# Altium project LARIX_V5.PrjPcb
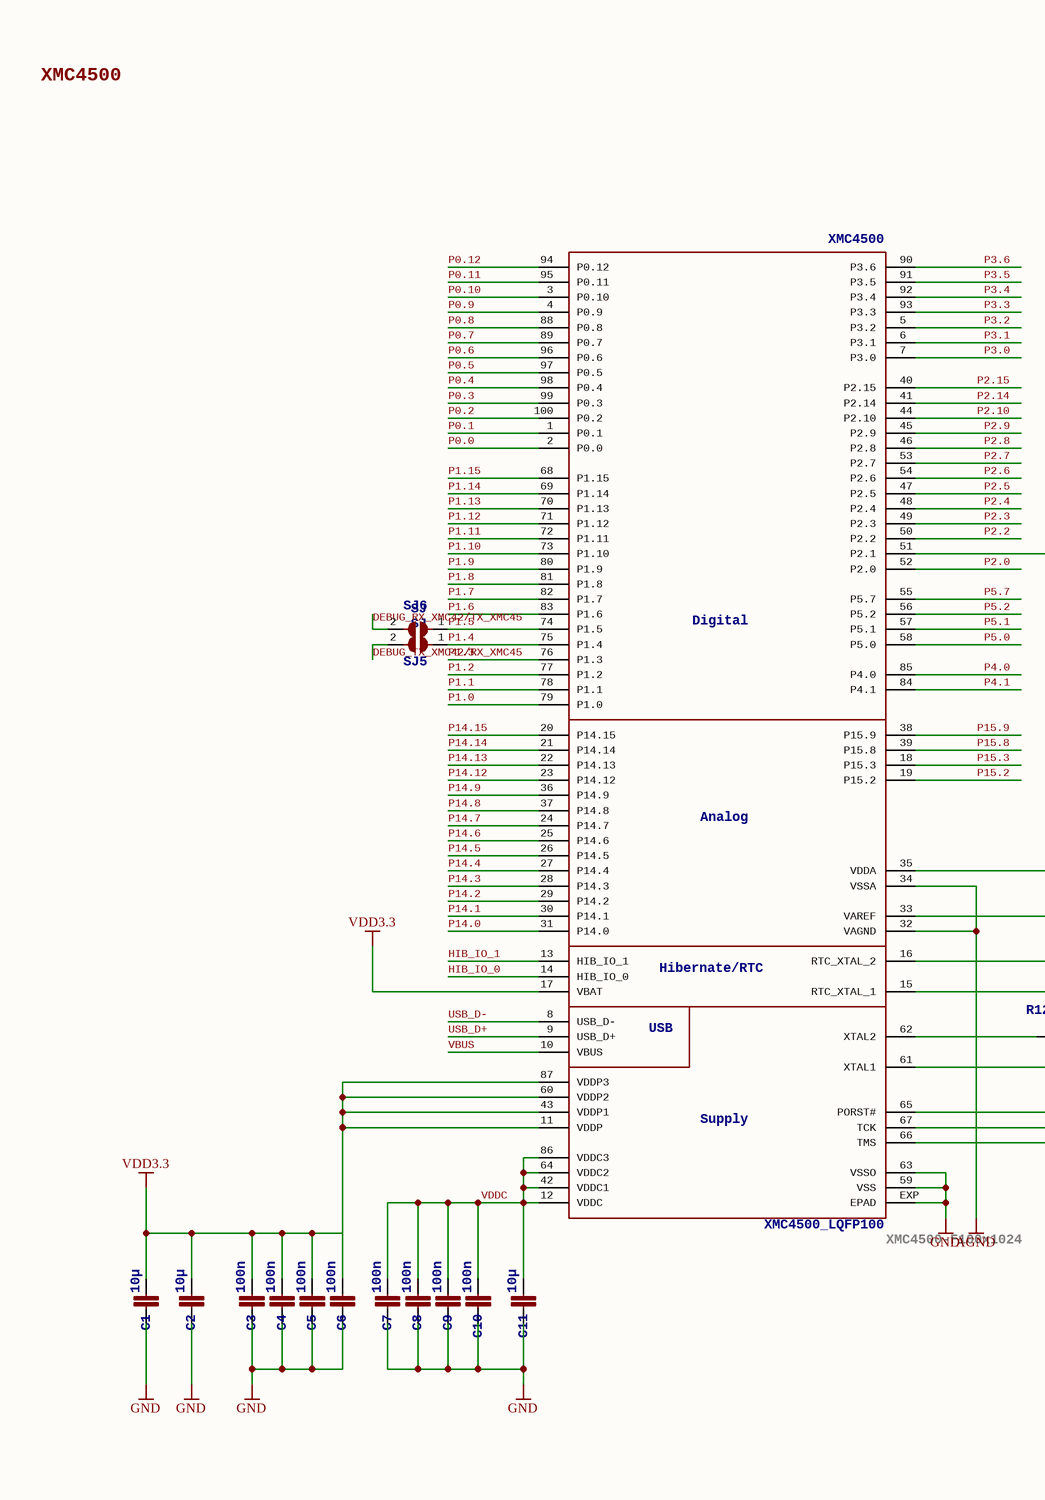
[diagram p0: LARIX_V5_0.SchDoc, left]
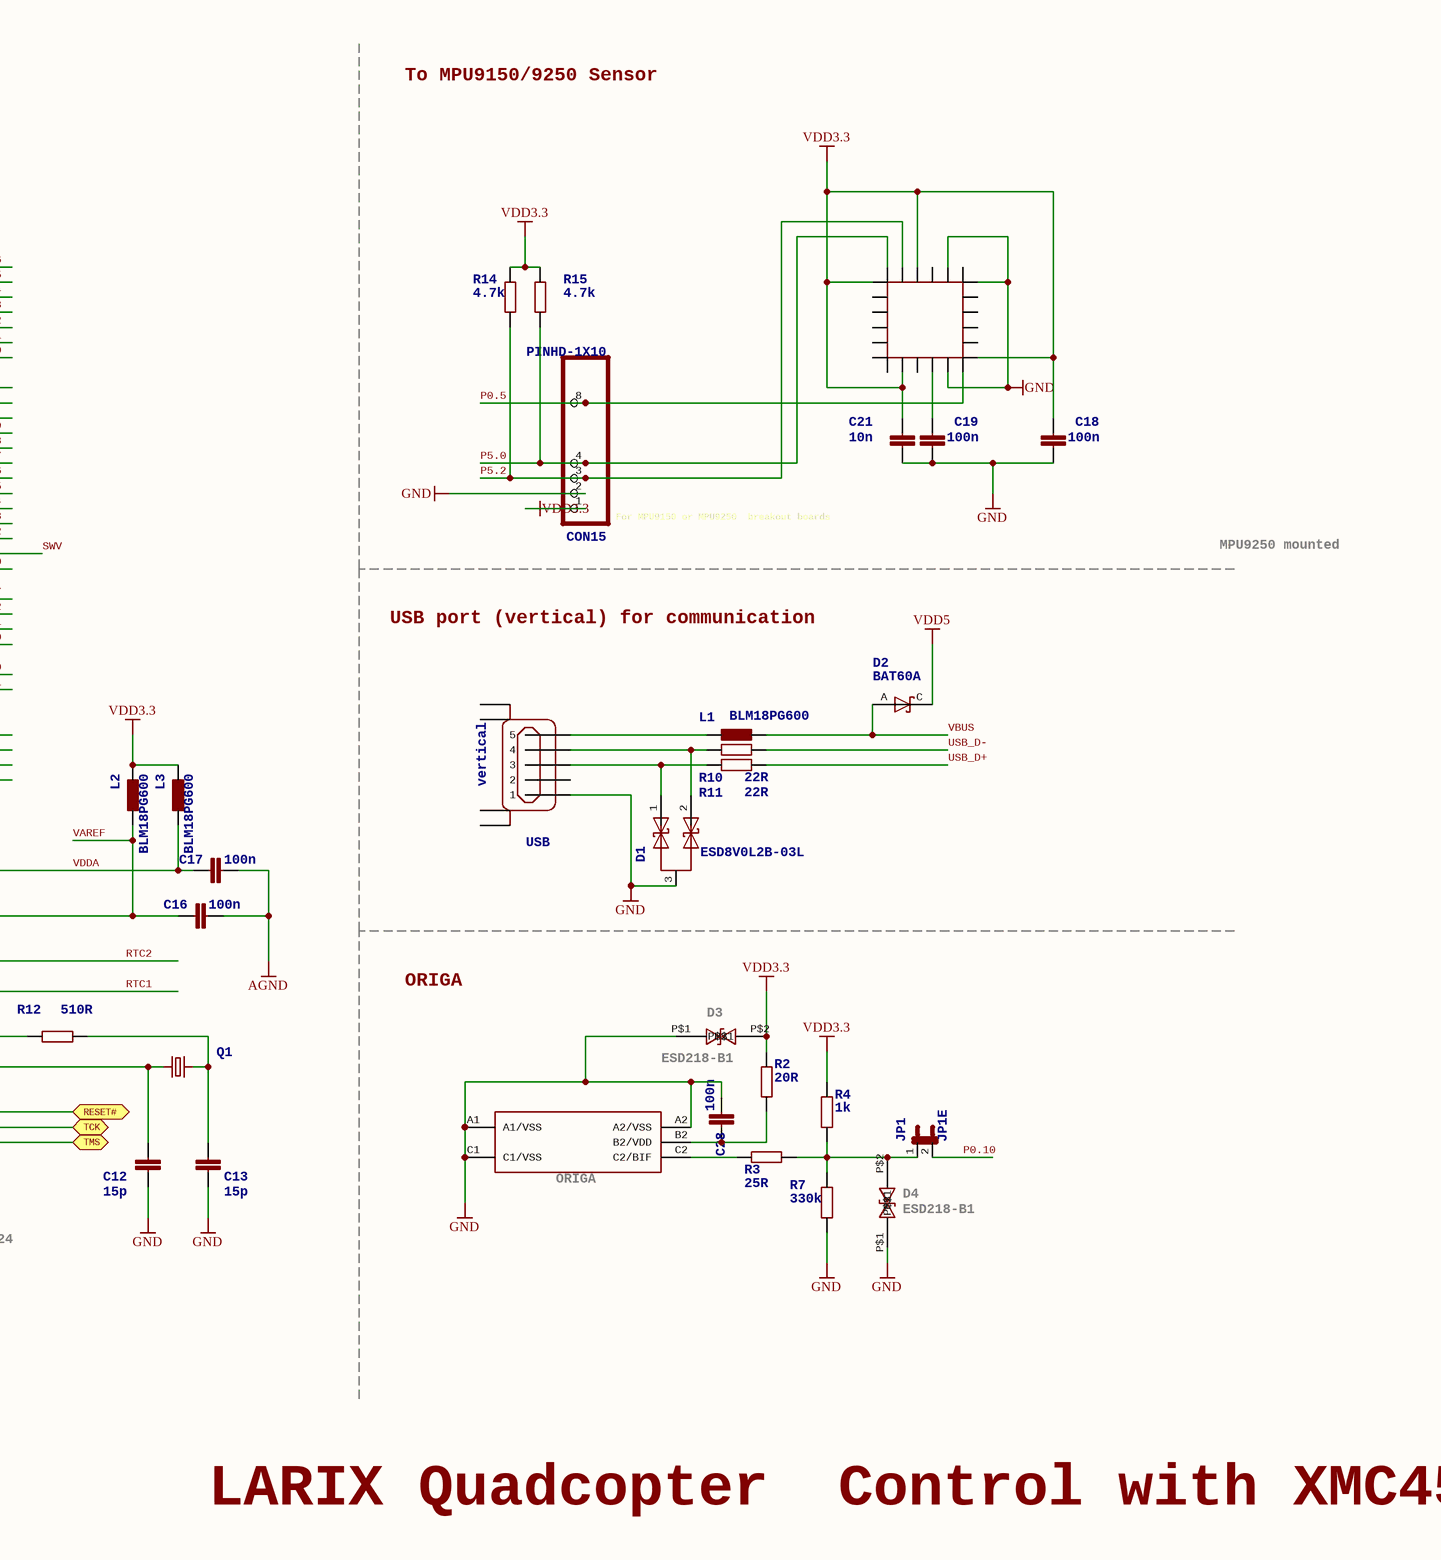
[diagram p1: LARIX_V5_0.SchDoc, right]
3 sheets, 174 parts. Net scope: flat (ports and power ports of the same name join across sheets).
Board file: LARIX_V5.PcbDoc
Sheets:
  LARIX_V5_0.SchDoc
  LARIX_V5_1.SchDoc
  LARIX_V5_2.SchDoc

## Sheet LARIX_V5_0.SchDoc
size 409 x 282 mm; >DRAWING_NAME: LARIX_V5.sch; >LAST_DATE_TIME: 05.02.2016 10:43:52; >SHEET: 1; Sheet:: Sheet:; Legal Disclaimer: Legal Disclaimer; The information given in this document shall in no event be regarded as a guarantee of conditions or: The information given in this document shall in no event be regarded as a guarantee of conditions or; characteristics. With respect to any examples or hints given herein, any typical values stated herein and/or any: characteristics. With respect to any examples or hints given herein, any typical values stated herein and/or any; information regarding the application of the device, Infineon Technologies hereby disclaims any and all warranties: information regarding the application of the device, Infineon Technologies hereby disclaims any and all warranties; and liabilities of any kind, including without limitation, warranties of non-infringement of intellectual property rights: and liabilities of any kind, including without limitation, warranties of non-infringement of intellectual property rights; of any third party.: of any third party.

### Parts
C1  10µ  [C0805K]
C2  10µ  [C0805K]
C3  100n  [C0603]
C4  100n  [C0603]
C5  100n  [C0603]
C6  100n  [C0603]
C7  100n  [C0603]
C8  100n  [C0603]
C9  100n  [C0603]
C10  100n  [C0603]
C11  10µ  [C0805K]
C12  15p  [C0603]
C13  15p  [C0603]
C16  100n  [C0603]
C17  100n  [C0603]
C18  100n  [C0603]
C19  100n  [C0603]
C21  10n  [C0603]
C28  100n  [C0603]
CON15  >NAME: CON15  [1X10]  (hidden comment: PINHD-1X10)
D1  ESD8V0L2B-03L  [TSLP-3-1]
D2  BAT60A  [SOD323-R]
D3  ESD218-B1-02EL  [TSLP-2-20]  (value not drawn)
D4  ESD218-B1-02EL  [TSLP-2-20]  (value not drawn)
JP1  JP1E  [JP1]
L1  BLM18PG600  [L1608]
L2  >NAME: L2  [L1608]  (hidden comment: BLM18PG600)
L3  >NAME: L3  [L1608]  (hidden comment: BLM18PG600)
MPU9250  MPU9250  [QFN3X3-24+]  (value not drawn)
ORIGA  ORIGA2L  [WLB-5]  (value not drawn)
Q1  12MHZ/S/3.2X2.5  [32X25_4PAD]  (value not drawn)
R2  20R  [R0603]
R3  25R  [R0603]
R4  1k  [R0603]
R7  330k  [R0603]
R10  22R  [R0603]
R11  22R  [R0603]
R12  510R  [R0603]
R14  4.7k  [R0603]
R15  4.7k  [R0603]
SJ5  SJ  [SJ]
SJ6  SJ  [SJ]
USB  vertical  [USBVERTICAL]
XMC4500  >NAME: XMC4500  [P/PG-LQFP-100-11]  (hidden comment: XMC4500_LQFP100)

### Ports
RESET#, TCK, TMS

### Nets
AGND: C16.2 C17.2 XMC4500.32(VAGND) XMC4500.34(VSSA)
GND: C1.2 C2.2 C3.2 C4.2 C5.2 C6.2 C7.2 C8.2 C9.2 C10.2 C11.2 C12.2 C13.2 C18.1 C19.1 C21.1 C28.1 CON15.2 D1.3 D3.P$1 D4.P$1 MPU9250.11 MPU9250.18 MPU9250.20 ORIGA.A1(A1/VSS) ORIGA.A2(A2/VSS) ORIGA.C1(C1/VSS) R7.2 USB.1 XMC4500.59(VSS) XMC4500.63(VSSO) XMC4500.EXP(EPAD)
VDD3.3: C1.1 C2.1 C3.1 C4.1 C5.1 C6.1 C18.2 C21.2 CON15.1 D3.P$2 L2.2 L3.2 MPU9250.1 MPU9250.8 MPU9250.13 MPU9250.22 R2.1 R4.1 R14.2 R15.2 XMC4500.11(VDDP) XMC4500.17(VBAT) XMC4500.43(VDDP1) XMC4500.60(VDDP2) XMC4500.87(VDDP3)
VDD5: D2.C
DEBUG_RX_XMC42/TX_XMC45: SJ6.2
DEBUG_TX_XMC42/RX_XMC45: SJ5.2
HIB_IO_0: XMC4500.14(HIB_IO_0)
HIB_IO_1: XMC4500.13(HIB_IO_1)
P0.0: XMC4500.2(P0.0)
P0.1: XMC4500.1(P0.1)
P0.2: XMC4500.100(P0.2)
P0.3: XMC4500.99(P0.3)
P0.4: XMC4500.98(P0.4)
P0.5: CON15.8 MPU9250.12 XMC4500.97(P0.5)
P0.6: XMC4500.96(P0.6)
P0.7: XMC4500.89(P0.7)
P0.8: XMC4500.88(P0.8)
P0.9: XMC4500.4(P0.9)
P0.10: JP1.2 XMC4500.3(P0.10)
P0.11: XMC4500.95(P0.11)
P0.12: XMC4500.94(P0.12)
P1.0: XMC4500.79(P1.0)
P1.1: XMC4500.78(P1.1)
P1.2: XMC4500.77(P1.2)
P1.3: XMC4500.76(P1.3)
P1.4: SJ5.1 XMC4500.75(P1.4)
P1.5: SJ6.1 XMC4500.74(P1.5)
P1.6: XMC4500.83(P1.6)
P1.7: XMC4500.82(P1.7)
P1.8: XMC4500.81(P1.8)
P1.9: XMC4500.80(P1.9)
P1.10: XMC4500.73(P1.10)
P1.11: XMC4500.72(P1.11)
P1.12: XMC4500.71(P1.12)
P1.13: XMC4500.70(P1.13)
P1.14: XMC4500.69(P1.14)
P1.15: XMC4500.68(P1.15)
P2.0: XMC4500.52(P2.0)
P2.2: XMC4500.50(P2.2)
P2.3: XMC4500.49(P2.3)
P2.4: XMC4500.48(P2.4)
P2.5: XMC4500.47(P2.5)
P2.6: XMC4500.54(P2.6)
P2.7: XMC4500.53(P2.7)
P2.8: XMC4500.46(P2.8)
P2.9: XMC4500.45(P2.9)
P2.10: XMC4500.44(P2.10)
P2.14: XMC4500.41(P2.14)
P2.15: XMC4500.40(P2.15)
P3.0: XMC4500.7(P3.0)
P3.1: XMC4500.6(P3.1)
P3.2: XMC4500.5(P3.2)
P3.3: XMC4500.93(P3.3)
P3.4: XMC4500.92(P3.4)
P3.5: XMC4500.91(P3.5)
P3.6: XMC4500.90(P3.6)
P4.0: XMC4500.85(P4.0)
P4.1: XMC4500.84(P4.1)
P5.0: CON15.4 MPU9250.24 R15.1 XMC4500.58(P5.0)
P5.1: XMC4500.57(P5.1)
P5.2: CON15.3 MPU9250.23 R14.1 XMC4500.56(P5.2)
P5.7: XMC4500.55(P5.7)
P14.0: XMC4500.31(P14.0)
P14.1: XMC4500.30(P14.1)
P14.2: XMC4500.29(P14.2)
P14.3: XMC4500.28(P14.3)
P14.4: XMC4500.27(P14.4)
P14.5: XMC4500.26(P14.5)
P14.6: XMC4500.25(P14.6)
P14.7: XMC4500.24(P14.7)
P14.8: XMC4500.37(P14.8)
P14.9: XMC4500.36(P14.9)
P14.12: XMC4500.23(P14.12)
P14.13: XMC4500.22(P14.13)
P14.14: XMC4500.21(P14.14)
P14.15: XMC4500.20(P14.15)
P15.2: XMC4500.19(P15.2)
P15.3: XMC4500.18(P15.3)
P15.8: XMC4500.39(P15.8)
P15.9: XMC4500.38(P15.9)
RTC1: XMC4500.15(RTC_XTAL_1)
RTC2: XMC4500.16(RTC_XTAL_2)
SWV: XMC4500.51(P2.1)
USB_D+: R11.2 XMC4500.9(USB_D+)
USB_D-: R10.2 XMC4500.8(USB_D-)
VAREF: C16.1 L2.1 XMC4500.33(VAREF)
VBUS: D2.A L1.1 XMC4500.10(VBUS)
VDDA: C17.1 L3.1 XMC4500.35(VDDA)
VDDC: C7.1 C8.1 C9.1 C10.1 C11.1 XMC4500.12(VDDC) XMC4500.42(VDDC1) XMC4500.64(VDDC2) XMC4500.86(VDDC3)
NetC12_1: C12.1 Q1.1 XMC4500.61(XTAL1)
NetC13_1: C13.1 Q1.3 R12.2
NetC19_2: C19.2 MPU9250.10
NetC28_2: C28.2 ORIGA.B2(B2/VDD) R2.2
NetD1_1: D1.1 R11.1 USB.3+(3)
NetD1_2: D1.2 R10.1 USB.4
NetD4_P$2: D4.P$2 JP1.1 R3.2 R4.2 R7.1
NetL1_2: L1.2 USB.5
NetORIGA_C2: ORIGA.C2(C2/BIF) R3.1
NetR12_1: R12.1 XMC4500.62(XTAL2)
NetXMC4500_65: XMC4500.65(PORST#) ; port RESET#
NetXMC4500_66: XMC4500.66(TMS) ; port TMS
NetXMC4500_67: XMC4500.67(TCK) ; port TCK

Not connected (* = marked no-connect by the designer): MPU9250 2 3 4 5 6 7 9 14 15 16 17 19 21; USB 2 P$1(PGH1) P$2(PGH2) P$3(PGH3) P$4(PGH4)

### Notes on the sheet
- XMC4500
- To MPU9150/9250 Sensor
- (near CON15) For MPU9150
  or MPU9250
  breakout boards
- MPU9250 mounted
- USB port (vertical) for communication
- ORIGA
- (near D3) D3
- (near D3) ESD218-B1
- (near ORIGA) ORIGA
- (near XMC4500) XMC4500-F100x1024
- (near D4) D4
- (near D4) ESD218-B1
- LARIX Quadcopter
  Control with XMC4500
- 1
- 2
- 3
- 4
- 5
- 6
- 7
- 8
- A
- B
- C
- D
- E

### Library data of the parts
C1 C2 C11 = C-EUC0805K: <B>CAPACITOR</B>, European symbol
C3-C10 C12 C13 C16-C19 C21 C28 = C-EUC0603: <B>CAPACITOR</B>, European symbol
CON15 = PINHD-1X10: <b>PIN HEADER</b>; >VALUE: PINHD-1X10
D2 = BAT60
JP1 = JP1E: <b>JUMPER</b>; >NAME: JP1; >VALUE: JP1E
L1-L3 = L_EU_L0603
  L2 L3: >VALUE: BLM18PG600
MPU9250 = INVENSENSE9250HERBY: Herbys Model of a invensense 9250
Q1 = NX3225_2
R2-R4 R7 R12 = R-EU_R0603
R10 R11 R14 R15 = R-EU_R0603: <B>RESISTOR</B>, European symbol
SJ5 SJ6 = SJ: SMD solder <b>JUMPER</b>
USB = MICRO_USB_VERTICAL
XMC4500 = XMC4400_LQFP100: >VALUE: XMC4500_LQFP100; USB: USB; Supply: Supply; Analog: Analog; Digital: Digital; Hibernate/RTC: Hibernate/RTC

## Sheet LARIX_V5_1.SchDoc
size 409 x 282 mm; >DRAWING_NAME: LARIX_V5.sch; >LAST_DATE_TIME: 05.02.2016 10:43:52; >SHEET: 2; Sheet:: Sheet:; Legal Disclaimer: Legal Disclaimer; The information given in this document shall in no event be regarded as a guarantee of conditions or: The information given in this document shall in no event be regarded as a guarantee of conditions or; characteristics. With respect to any examples or hints given herein, any typical values stated herein and/or any: characteristics. With respect to any examples or hints given herein, any typical values stated herein and/or any; information regarding the application of the device, Infineon Technologies hereby disclaims any and all warranties: information regarding the application of the device, Infineon Technologies hereby disclaims any and all warranties; and liabilities of any kind, including without limitation, warranties of non-infringement of intellectual property rights: and liabilities of any kind, including without limitation, warranties of non-infringement of intellectual property rights; of any third party.: of any third party.
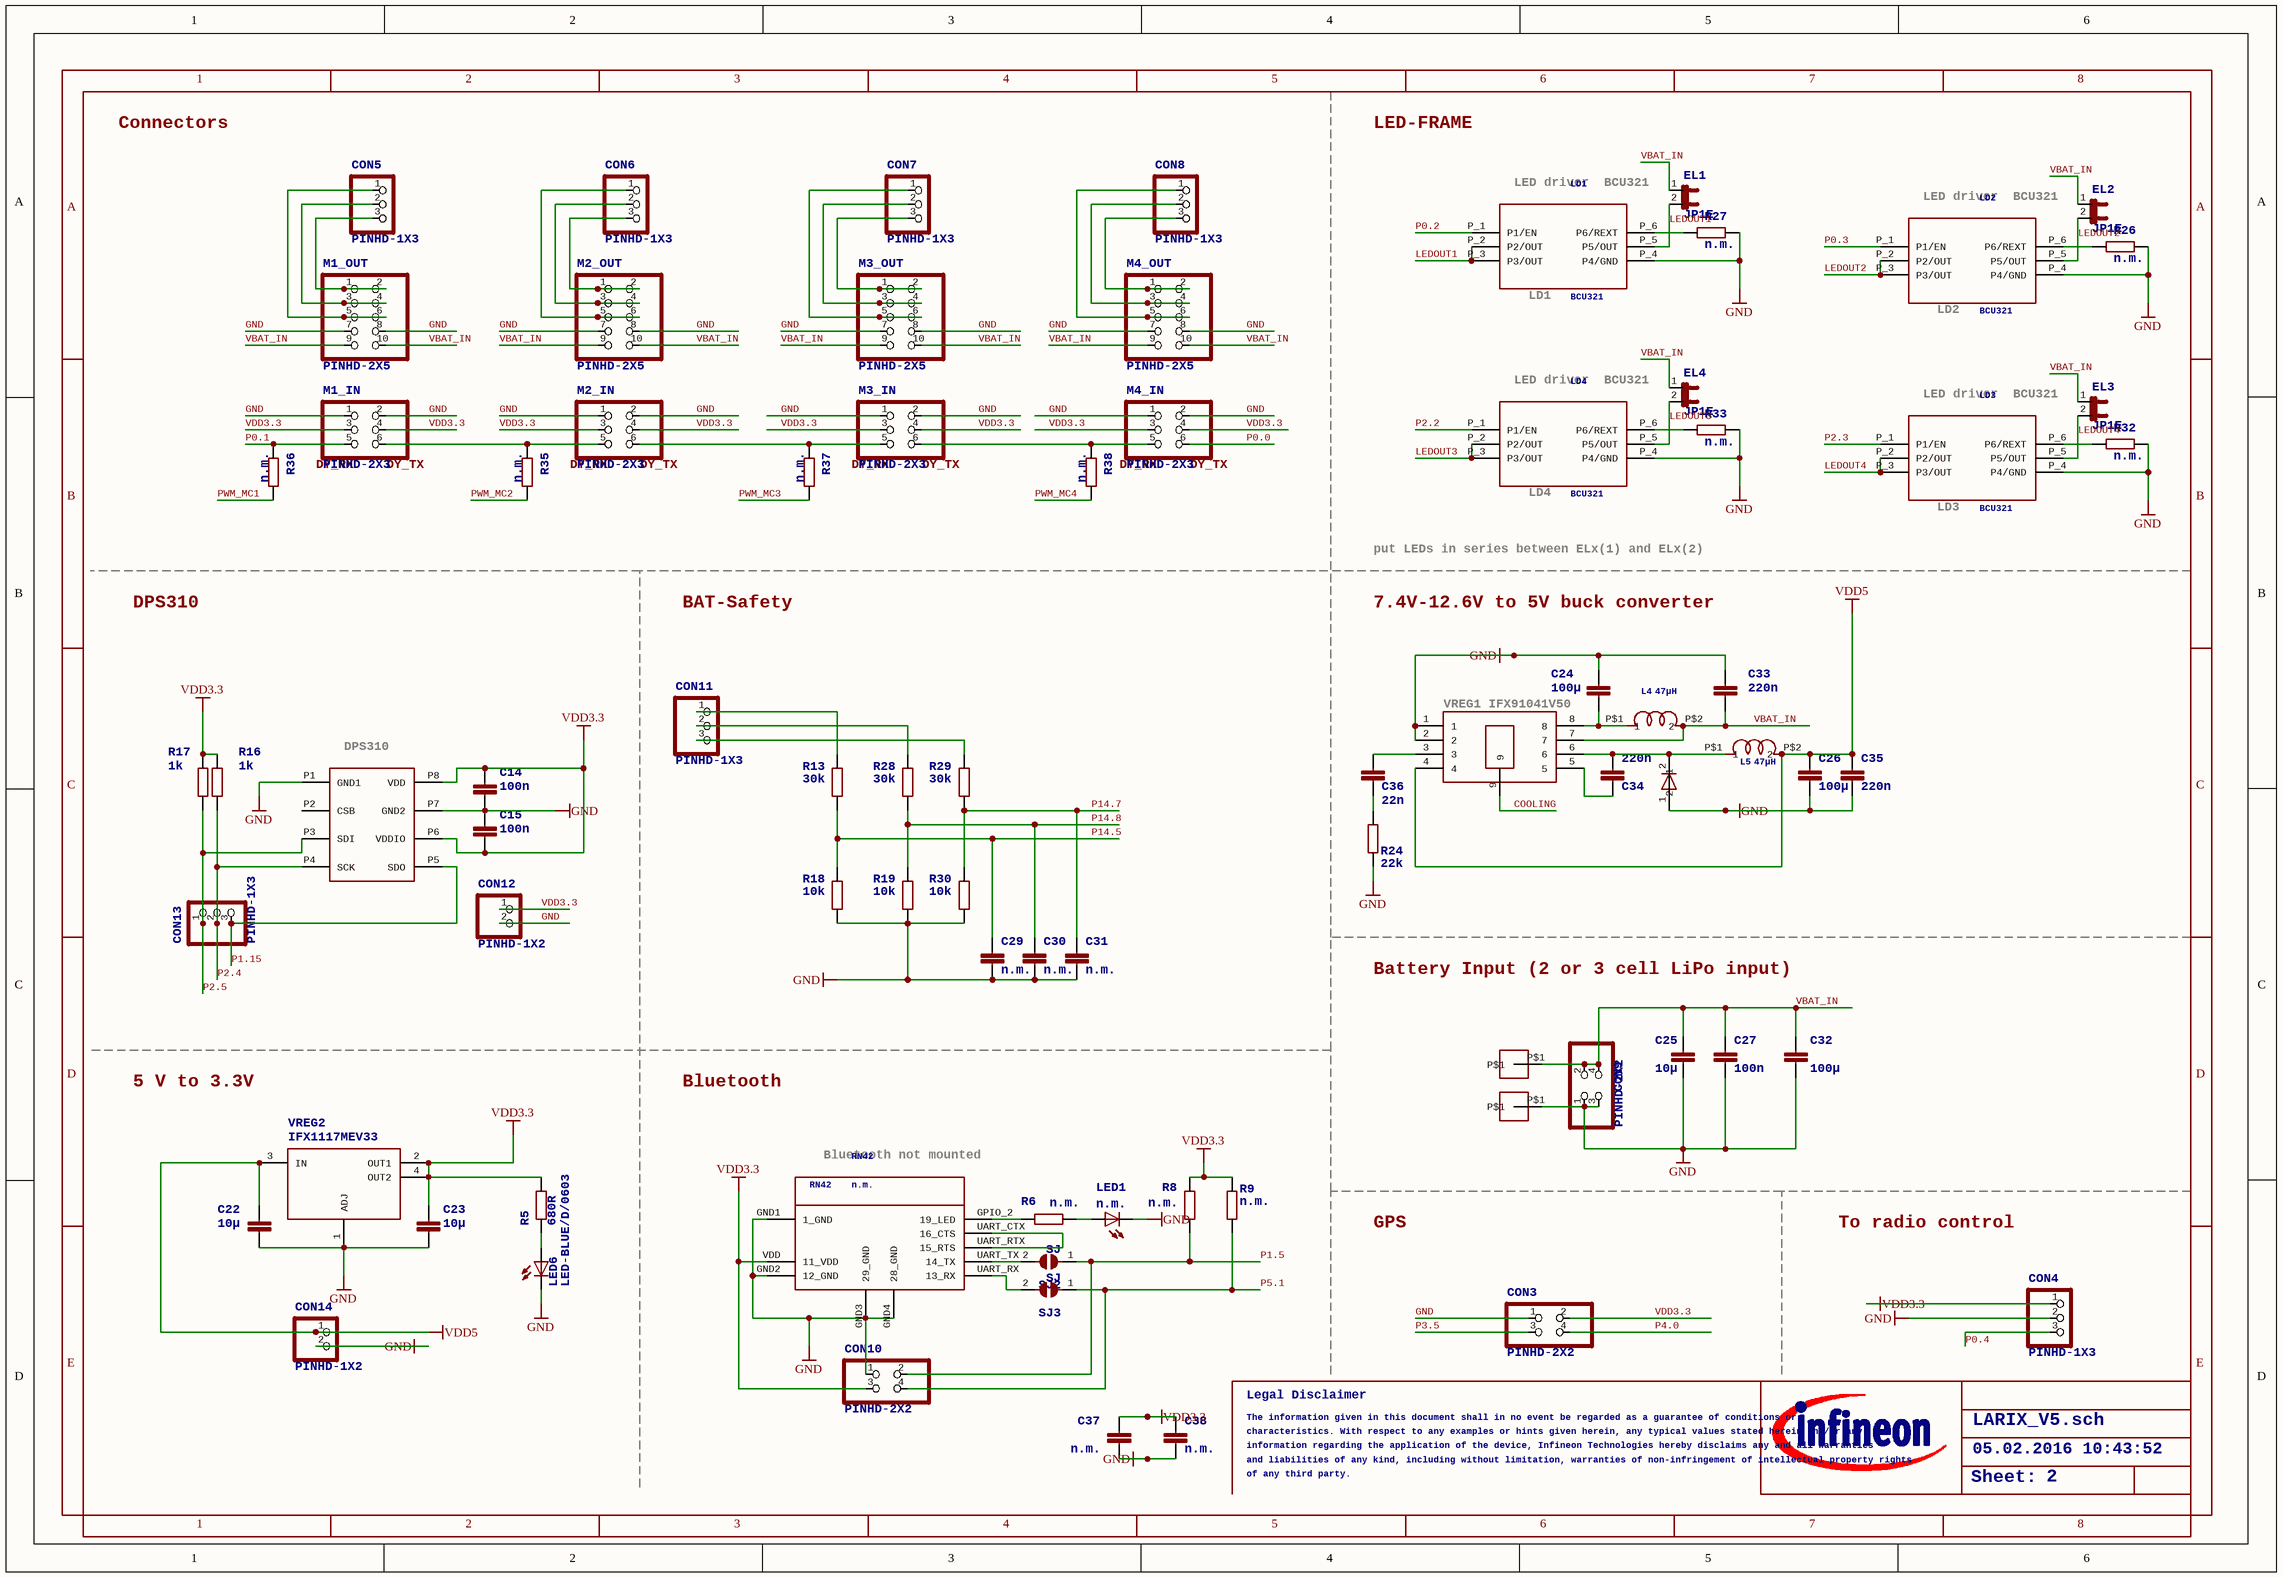
[diagram p2: LARIX_V5_1.SchDoc]

### Parts
C14  100n  [C0603]
C15  100n  [C0603]
C22  10µ  [C0805K]
C23  10µ  [C0805K]
C24  100µ  [C1210]
C25  10µ  [C0805K]
C26  >NAME: C26  [C1210]  (hidden comment: 100µ)
C27  100n  [C0603]
C29  n.m.  [C0603]
C30  n.m.  [C0603]
C31  n.m.  [C0603]
C32  100µ  [C1210]
C33  220n  [C0603]
C34  220n  [C0603]
C35  220n  [C0603]
C36  22n  [C0603]
C37  n.m.  [C0805K]
C38  n.m.  [C0603]
CON3  >NAME: CON3  [2X02]  (hidden comment: PINHD-2X2)
CON4  >NAME: CON4  [1X03]  (hidden comment: PINHD-1X3)
CON5  >NAME: CON5  [1X03]  (hidden comment: PINHD-1X3)
CON6  >NAME: CON6  [1X03]  (hidden comment: PINHD-1X3)
CON7  >NAME: CON7  [1X03]  (hidden comment: PINHD-1X3)
CON8  >NAME: CON8  [1X03]  (hidden comment: PINHD-1X3)
CON9  PINHD-2X2  [2X02]
CON10  >NAME: CON10  [2X02]  (hidden comment: PINHD-2X2)
CON11  >NAME: CON11  [1X03]  (hidden comment: PINHD-1X3)
CON12  >NAME: CON12  [1X02]  (hidden comment: PINHD-1X2)
CON13  >NAME: CON13  [1X03]  (hidden comment: PINHD-1X3)
CON14  >NAME: CON14  [1X02]  (hidden comment: PINHD-1X2)
D6  BAS21-03W  [INF-SOD323_V_1PRIMARY]  (value not drawn)
DPS310  Infineon  [LGA8R125P0X4_500X300X120]  (value not drawn)
EL1  >NAME: EL1  [JP1]  (hidden comment: JP1E)
EL2  >NAME: EL2  [JP1]  (hidden comment: JP1E)
EL3  >NAME: EL3  [JP1]  (hidden comment: JP1E)
EL4  >NAME: EL4  [JP1]  (hidden comment: JP1E)
L4  47µH  [WE-TPC]
L5  47µH  [WE-TPC]
LD1  >NAME: LD1  [SC74]  (hidden comment: BCU321)
LD2  >NAME: LD2  [SC74]  (hidden comment: BCU321)
LD3  >NAME: LD3  [SC74]  (hidden comment: BCU321)
LD4  >NAME: LD4  [SC74]  (hidden comment: BCU321)
LED1  n.m.  [CHIPLED_0603]
LED6  >NAME: LED6  [CHIPLED_0603]  (hidden comment: LED-BLUE/D/0603)
M1_IN  >NAME: M1_IN  [2X03]  (hidden comment: PINHD-2X3)
M1_OUT  >NAME: M1_OUT  [2X05]  (hidden comment: PINHD-2X5)
M2_IN  >NAME: M2_IN  [2X03]  (hidden comment: PINHD-2X3)
M2_OUT  >NAME: M2_OUT  [2X05]  (hidden comment: PINHD-2X5)
M3_IN  >NAME: M3_IN  [2X03]  (hidden comment: PINHD-2X3)
M3_OUT  >NAME: M3_OUT  [2X05]  (hidden comment: PINHD-2X5)
M4_IN  >NAME: M4_IN  [2X03]  (hidden comment: PINHD-2X3)
M4_OUT  >NAME: M4_OUT  [2X05]  (hidden comment: PINHD-2X5)
PAD1  PAD-BATTERY  [BATT-SOLDER]  (value not drawn)
PAD2  PAD-BATTERY  [BATT-SOLDER]  (value not drawn)
R5  >NAME: R5  [R0603]  (hidden comment: 680R)
R6  n.m.  [R0603]
R8  n.m.  [R0603]
R9  n.m.  [R0603]
R13  30k  [R0603]
R16  1k  [R0603]
R17  1k  [R0603]
R18  10k  [R0603]
R19  10k  [R0603]
R24  22k  [R0603]
R26  n.m.  [R0603]
R27  n.m.  [R0603]
R28  30k  [R0603]
R29  30k  [R0603]
R30  10k  [R0603]
R32  n.m.  [R0603]
R33  n.m.  [R0603]
R35  >NAME: R35  [R0603]  (hidden comment: n.m.)
R36  >NAME: R36  [R0603]  (hidden comment: n.m.)
R37  >NAME: R37  [R0603]  (hidden comment: n.m.)
R38  >NAME: R38  [R0603]  (hidden comment: n.m.)
RN42  >NAME: RN42  [RN42+SHIELD]  (hidden comment: n.m.)
SJ2  >NAME: SJ2  [SJ]  (hidden comment: SJ)
SJ3  >NAME: SJ3  [SJ]  (hidden comment: SJ)
VREG1  IFX91041V50  [INF-PG-DSO-8-27_N_1PRIMARY]  (value not drawn)
VREG2  >NAME: VREG2  [SOT223]  (hidden comment: IFX1117MEV33)

### Nets
GND: C14.2 C15.1 C22.2 C23.2 C24.1 C25.2 C26.2 C27.2 C29.2 C30.2 C31.2 C32.2 C33.1 C35.2 C37.2 C38.2 CON3.1 CON4.2 CON9.1 CON9.3 CON10.1 CON12.2 CON14.2 D6.1 DPS310.P1(GND1) DPS310.P7(GND2) LD1.P_4(P4/GND) LD2.P_4(P4/GND) LD3.P_4(P4/GND) LD4.P_4(P4/GND) LED1.C LED6.C M1_IN.1 M1_IN.2 M1_OUT.7 M1_OUT.8 M2_IN.1 M2_IN.2 M2_OUT.7 M2_OUT.8 M3_IN.1 M3_IN.2 M3_OUT.7 M3_OUT.8 M4_IN.1 M4_IN.2 M4_OUT.7 M4_OUT.8 PAD2.P$1 R18.2 R19.2 R24.2 R26.2 R27.2 R30.2 R32.2 R33.2 RN42.GND1(1_GND) RN42.GND2(12_GND) RN42.GND3(29_GND) RN42.GND4(28_GND) VREG1.1 VREG1.2 VREG2.1(ADJ)
VDD3.3: C14.1 C15.2 C23.1 C37.1 C38.1 CON3.2 CON4.1 CON10.3 CON12.1 DPS310.P6(VDDIO) DPS310.P8(VDD) M1_IN.3 M1_IN.4 M2_IN.3 M2_IN.4 M3_IN.3 M3_IN.4 M4_IN.3 M4_IN.4 R5.2 R8.1 R9.1 R16.1 R17.1 RN42.VDD(11_VDD) VREG2.2(OUT1) VREG2.4(OUT2)
VDD5: C22.1 C26.1 C35.1 CON14.1 L5.P$2(2) VREG1.4 VREG2.3(IN)
COOLING: VREG1.9
LEDOUT1: EL1.2 LD1.P_2(P2/OUT) LD1.P_3(P3/OUT) LD1.P_5(P5/OUT)
LEDOUT2: EL2.2 LD2.P_2(P2/OUT) LD2.P_3(P3/OUT) LD2.P_5(P5/OUT)
LEDOUT3: EL4.2 LD4.P_2(P2/OUT) LD4.P_3(P3/OUT) LD4.P_5(P5/OUT)
LEDOUT4: EL3.2 LD3.P_2(P2/OUT) LD3.P_3(P3/OUT) LD3.P_5(P5/OUT)
P0.0: M4_IN.6
P0.1: M1_IN.5 R36.1
P0.2: LD1.P_1(P1/EN)
P0.3: LD2.P_1(P1/EN)
P0.4: CON4.3
P1.5: CON10.2 R8.2 SJ2.1
P1.15: CON13.3 DPS310.P5(SDO)
P2.2: LD4.P_1(P1/EN)
P2.3: LD3.P_1(P1/EN)
P2.4: CON13.2 DPS310.P4(SCK) R16.2
P2.5: CON13.1 DPS310.P3(SDI) R17.2
P3.5: CON3.3
P4.0: CON3.4
P5.1: CON10.4 R9.2 SJ3.1
P14.5: C29.1 R13.2 R18.1
P14.7: C31.1 R29.2 R30.1
P14.8: C30.1 R19.1 R28.2
PWM_MC1: R36.2
PWM_MC2: R35.2
PWM_MC3: R37.2
PWM_MC4: R38.2
VBAT_IN: C25.1 C27.1 C32.1 C33.2 CON9.2 CON9.4 EL1.1 EL2.1 EL3.1 EL4.1 L4.P$2(2) M1_OUT.9 M1_OUT.10 M2_OUT.9 M2_OUT.10 M3_OUT.9 M3_OUT.10 M4_OUT.9 M4_OUT.10 PAD1.P$1 VREG1.7
NetC24_2: C24.2 L4.P$1(1) VREG1.8
NetC34_1: C34.1 D6.2 L5.P$1(1) VREG1.6
NetC34_2: C34.2 VREG1.5
NetC36_1: C36.1 VREG1.3
NetC36_2: C36.2 R24.1
NetCON5_1: CON5.1 M1_OUT.5 M1_OUT.6
NetCON5_2: CON5.2 M1_OUT.3 M1_OUT.4
NetCON5_3: CON5.3 M1_OUT.1 M1_OUT.2
NetCON6_1: CON6.1 M2_OUT.5 M2_OUT.6
NetCON6_2: CON6.2 M2_OUT.3 M2_OUT.4
NetCON6_3: CON6.3 M2_OUT.1 M2_OUT.2
NetCON7_1: CON7.1 M3_OUT.5 M3_OUT.6
NetCON7_2: CON7.2 M3_OUT.3 M3_OUT.4
NetCON7_3: CON7.3 M3_OUT.1 M3_OUT.2
NetCON8_1: CON8.1 M4_OUT.5 M4_OUT.6
NetCON8_2: CON8.2 M4_OUT.3 M4_OUT.4
NetCON8_3: CON8.3 M4_OUT.1 M4_OUT.2
NetCON11_1: CON11.1 R13.1
NetCON11_2: CON11.2 R28.1
NetCON11_3: CON11.3 R29.1
NetLD1_P_6: LD1.P_6(P6/REXT) R27.1
NetLD2_P_6: LD2.P_6(P6/REXT) R26.1
NetLD3_P_6: LD3.P_6(P6/REXT) R32.1
NetLD4_P_6: LD4.P_6(P6/REXT) R33.1
NetLED1_A: LED1.A R6.1
NetLED6_A: LED6.A R5.1
NetM1_IN_6: M1_IN.6 M2_IN.5 R35.1
NetM2_IN_6: M2_IN.6 M3_IN.5 R37.1
NetM3_IN_6: M3_IN.6 M4_IN.5 R38.1
NetR6_2: R6.2 RN42.GPIO_2(19_LED)
NetRN42_UART_CTX: RN42.UART_CTX(16_CTS) RN42.UART_RTX(15_RTS)
NetRN42_UART_RX: RN42.UART_RX(13_RX) SJ3.2
NetRN42_UART_TX: RN42.UART_TX(14_TX) SJ2.2

Not connected (* = marked no-connect by the designer): DPS310 P2(CSB)

### Notes on the sheet
- Connectors
- LED-FRAME
- LED driver
  BCU321
- (near LD1) LD1
- (near LD2) LD2
- (near M1_IN) DY_RX
- (near M1_IN) DY_TX
- (near M2_IN) DY_RX
- (near M2_IN) DY_TX
- (near M3_IN) DY_RX
- (near M3_IN) DY_TX
- DY_RX
- (near M4_IN) DY_TX
- (near LD4) LD4
- (near LD3) LD3
- DPS310
- BAT-Safety
- 7.4V-12.6V to 5V buck converter
- put LEDs in series between
  ELx(1) and ELx(2)
- (near DPS310) DPS310
- (near VREG1) VREG1
  IFX91041V50
- Battery Input (2 or 3 cell LiPo input)
- 5 V to 3.3V
- Bluetooth
- Bluetooth not mounted
- GPS
- To radio control
- 1
- 2
- 3
- 4
- 5
- 6
- 7
- 8
- A
- B
- C
- D
- E

### Library data of the parts
C14 C15 C27 C29-C31 C33-C36 C38 = C-EUC0603: <B>CAPACITOR</B>, European symbol
C22 C23 C25 C37 = C-EUC0805K: <B>CAPACITOR</B>, European symbol
C24 C26 C32 = C-EUC1210: <B>CAPACITOR</B>, European symbol
  C26: >VALUE: 100µ
CON3 CON9 CON10 = PINHD-2X2: <b>PIN HEADER</b>
  CON3 CON10: >VALUE: PINHD-2X2
CON4-CON8 CON11 CON13 = PINHD-1X3: <b>PIN HEADER</b>; >VALUE: PINHD-1X3
CON12 CON14 = PINHD-1X2: <b>PIN HEADER</b>; >VALUE: PINHD-1X2
D6 = INF-SOD323_V_1
DPS310 = DPS310DRUCKSENSOR
EL1-EL4 = JP1E: <b>JUMPER</b>; >VALUE: JP1E
L4 L5 = WUERTH47UHIND
LD1-LD4 = BCU320: >VALUE: BCU321
LED1 LED6 = LEDCHIPLED_0603: <b>LED</b><p> / <u>OSRAM</u>:<br> / - <u>CHIPLED</u><br> / LG R971, LG N971, LY N971, LG Q971, LY Q971, LO R971, LY R971 / LH N974, LH R974<br> / LS Q976, LO Q976, LY Q976<br> / LO Q996<br> / - <u>Hyper CHIPLED</u><br> / LW Q18S<br> / LB Q993, LB Q99A, LB R99A<br> / - <u>SideLED</u><br> / LS A670, LO A670, LY A670, LG A670, LP A670<br> / LB A673, LV A673, LT A673, LW A673<br> / LH A674<br> / LY A675<br> / LS A676, LA A676, LO A676, LY A676, LW A676<br> / LS A679, LY A679, LG A679<br> / -  <u>Hyper Micro SIDELED®</u><br> / LS Y876, LA Y876, LO Y876, LY Y876<br> / LT Y87S<br> / - <u>SmartLED</u><br> / LW L88C, LW L88S<br> / LB L89C, LB L89S, LG L890<br> / LS L89K, LO L89K, LY L89K<br> / LS L896, LA L896, LO L896, LY L896<br> / - <u>TOPLED</u><br> / LS T670, LO T670, LY T670, LG T670, LP T670<br> / LSG T670, LSP T670, LSY T670, LOP T670, LYG T670<br> / LG T671, LOG T671, LSG T671<br> / LB T673, LV T673, LT T673, LW T673<br> / LH T674<br> / LS T676, LA T676, LO T676, LY T676, LB T676, LH T676, LSB T676, LW T676<br> / LB T67C, LV T67C, LT T67C, LS T67K, LO T67K, LY T67K, LW E67C<br> / LS E67B, LA E67B, LO E67B, LY E67B, LB E67C, LV E67C, LT E67C<br> / LW T67C<br> / LS T679, LY T679, LG T679<br> / LS T770, LO T770, LY T770, LG T770, LP T770<br> / LB T773, LV T773, LT T773, LW T773<br> / LH T774<br> / LS E675, LA E675, LY E675, LS T675<br> / LS T776, LA T776, LO T776, LY T776, LB T776<br> / LHGB T686<br> / LT T68C, LB T68C<br> / - <u>Hyper Mini TOPLED®</u><br> / LB M676<br> / - <u>Mini TOPLED Santana®</u><br> / LG M470<br> / LS M47K, LO M47K, LY M47K<br> / <p> / Source: http://www.osram.convergy.de/
  LED6: >VALUE: LED-BLUE/D/0603
M1_IN M2_IN M3_IN M4_IN = PINHD-2X3: <b>PIN HEADER</b>; >VALUE: PINHD-2X3
M1_OUT M2_OUT M3_OUT M4_OUT = PINHD-2X5: <b>PIN HEADER</b>; >VALUE: PINHD-2X5
R5 R6 R8 R9 R13 R16-R19 R24 R28-R30 R37 = R-EU_R0603
  R5: >VALUE: 680R
  R37: >VALUE: n.m.
R26 R27 R32 R33 R35 R36 R38 = R-EU_R0603: <B>RESISTOR</B>, European symbol
  R35 R36 R38: >VALUE: n.m.
RN42 = BLUETOOTHRN42+SHIELD: RN42: RN42; >VALUE: n.m.
SJ2 SJ3 = SJ: SMD solder <b>JUMPER</b>; >VALUE: SJ
VREG1 = INF-PG-DSO-8-27_N_1
VREG2 = IFX1117: >VALUE: IFX1117MEV33

## Sheet LARIX_V5_2.SchDoc
size 409 x 282 mm; >DRAWING_NAME: LARIX_V5.sch; >LAST_DATE_TIME: 05.02.2016 10:43:53; >SHEET: 3; Sheet:: Sheet:; Legal Disclaimer: Legal Disclaimer; The information given in this document shall in no event be regarded as a guarantee of conditions or: The information given in this document shall in no event be regarded as a guarantee of conditions or; characteristics. With respect to any examples or hints given herein, any typical values stated herein and/or any: characteristics. With respect to any examples or hints given herein, any typical values stated herein and/or any; information regarding the application of the device, Infineon Technologies hereby disclaims any and all warranties: information regarding the application of the device, Infineon Technologies hereby disclaims any and all warranties; and liabilities of any kind, including without limitation, warranties of non-infringement of intellectual property rights: and liabilities of any kind, including without limitation, warranties of non-infringement of intellectual property rights; of any third party.: of any third party.
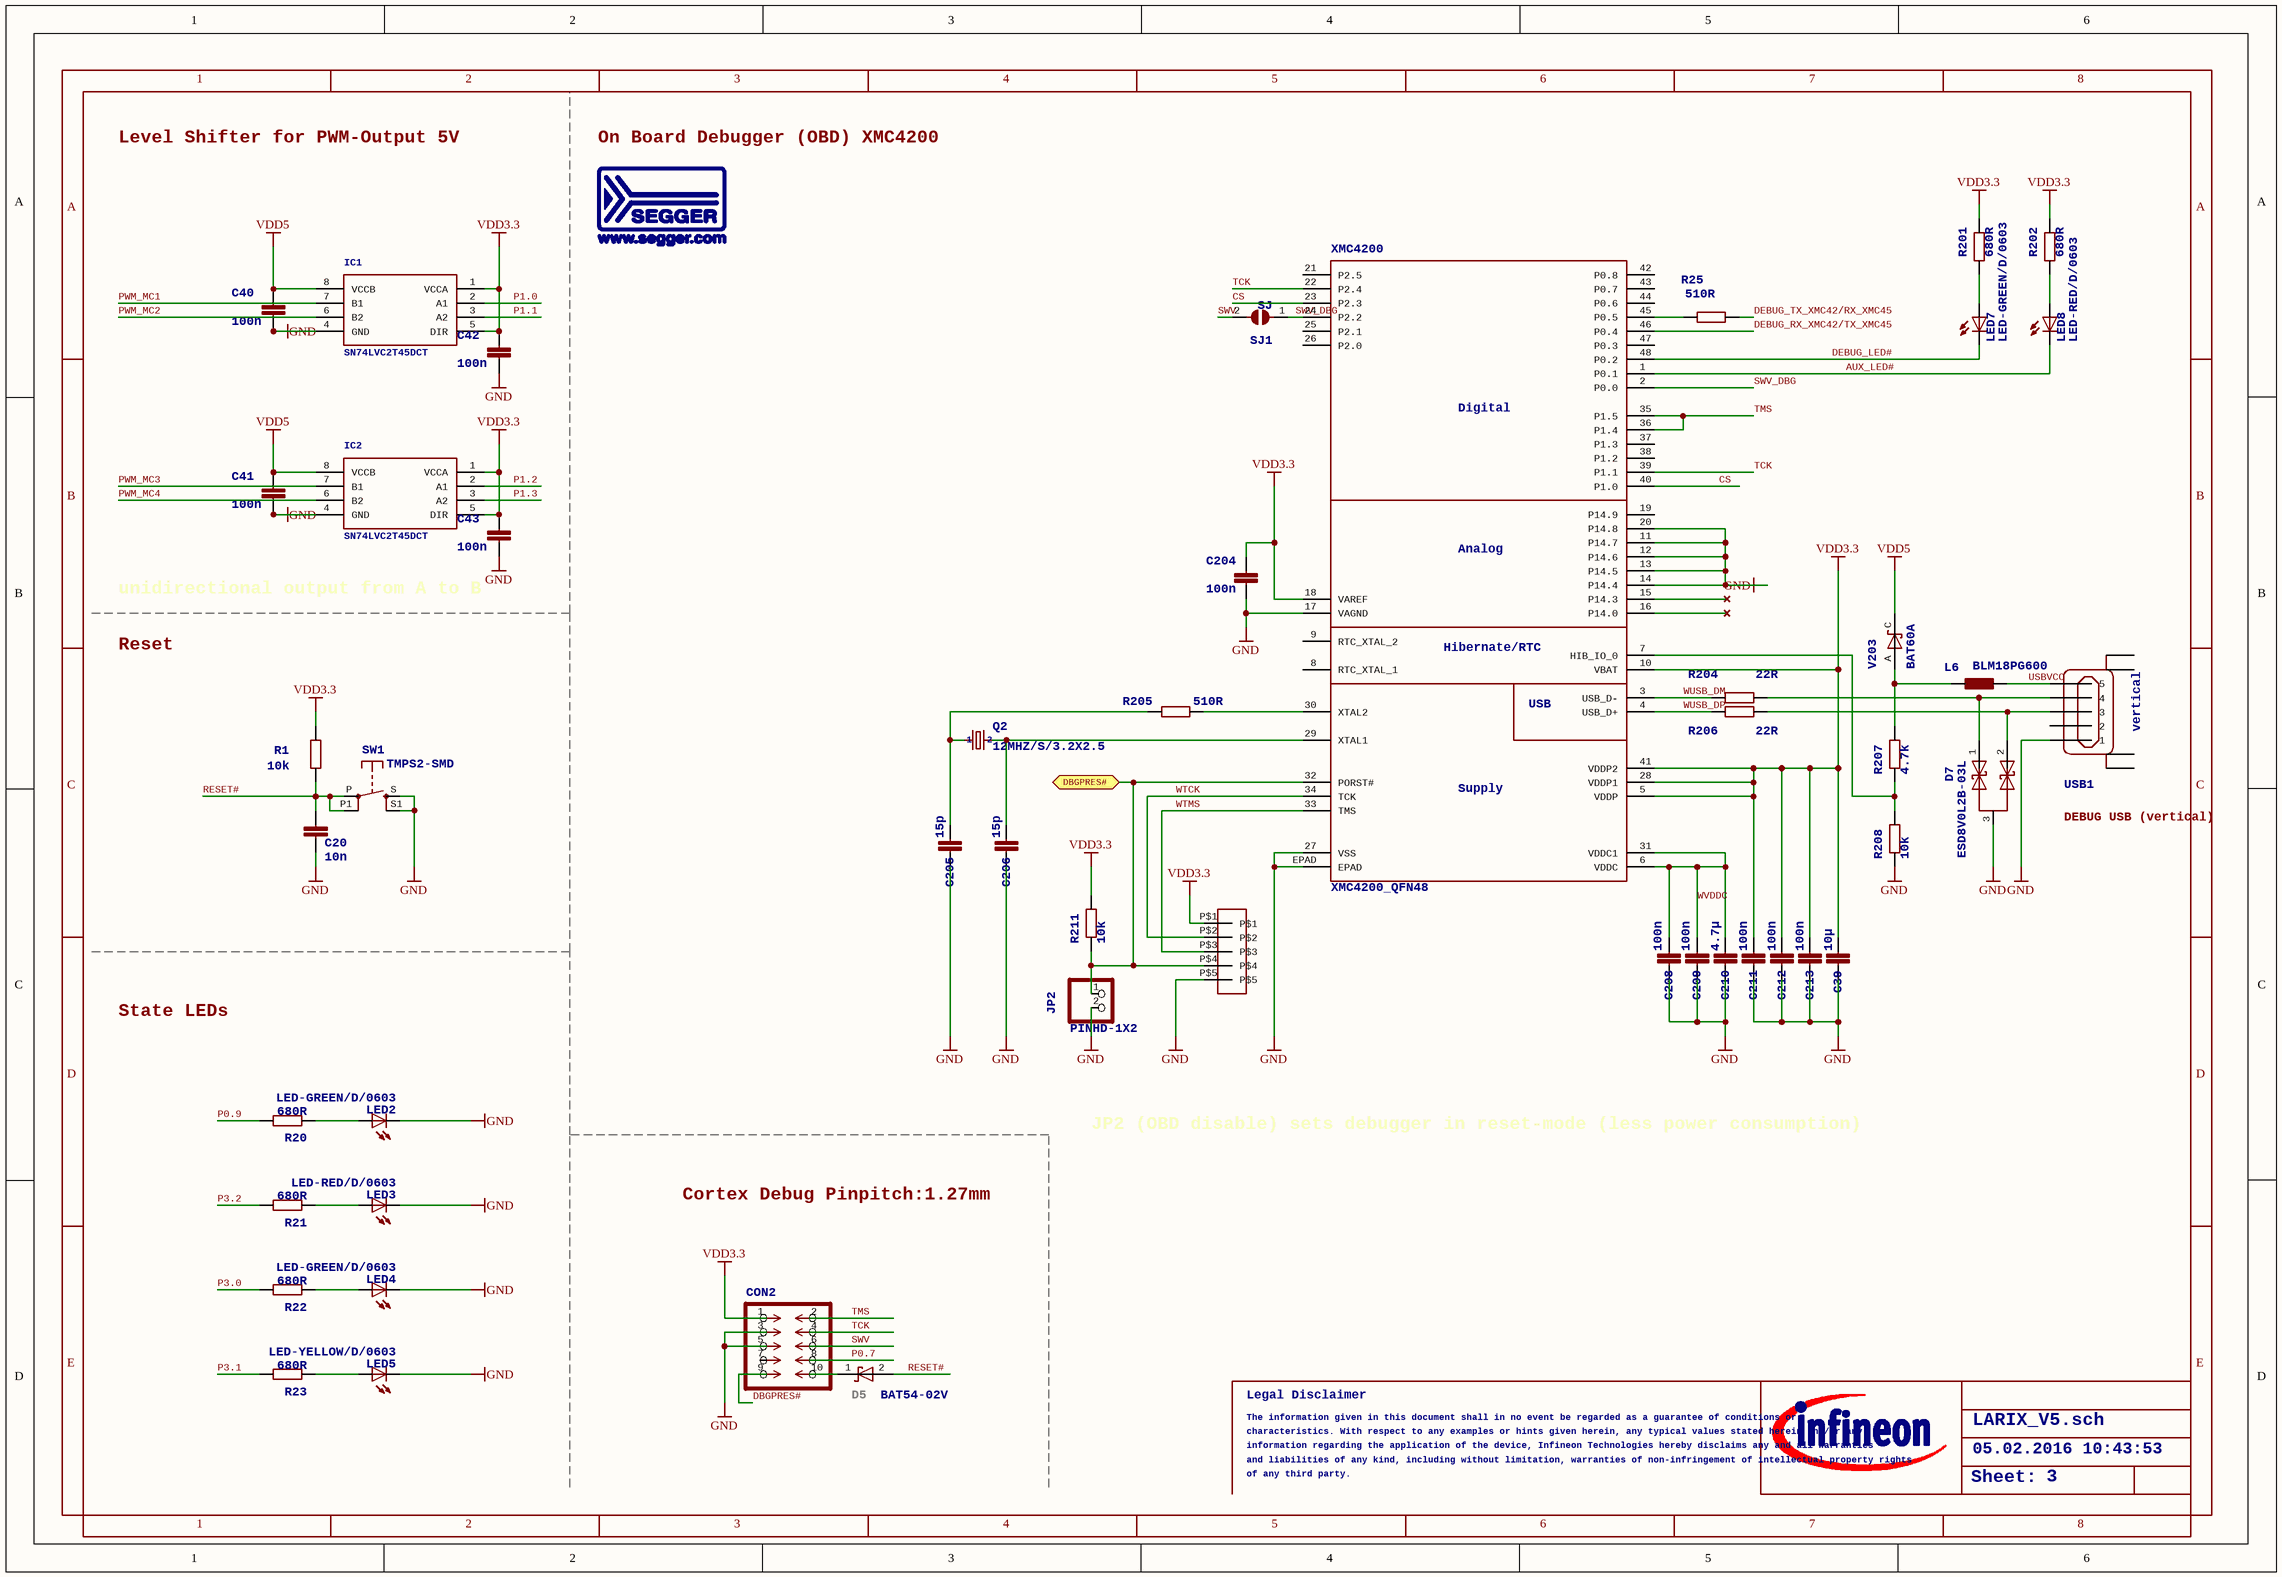
[diagram p3: LARIX_V5_2.SchDoc]

### Parts
C20  10n  [C0603]
C39  10µ  [C0805K]
C40  100n  [C0603]
C41  100n  [C0603]
C42  100n  [C0603]
C43  100n  [C0603]
C204  >NAME: C204  [C0402]  (hidden comment: 100n)
C205  15p  [C0402]
C206  15p  [C0402]
C208  100n  [C0402]
C209  100n  [C0402]
C210  4.7µ  [C0805K]
C211  100n  [C0402]
C212  100n  [C0402]
C213  100n  [C0402]
CON2  FTSH-105-01-F-D-K  [FTSH-105-01-F-D-K]  (value not drawn)
D5  BAT54-02V  [SC79]
D7  ESD8V0L2B-03L  [TSLP-3-1]
IC1  >NAME: IC1  [DCT_R-PDSO-G8]  (hidden comment: SN74LVC2T45DCT)
IC2  >NAME: IC2  [DCT_R-PDSO-G8]  (hidden comment: SN74LVC2T45DCT)
JP2  PINHD-1X2  [1X02]
L6  BLM18PG600  [L1608]
LED2  >NAME: LED2  [CHIPLED_0603]  (hidden comment: LED-GREEN/D/0603)
LED3  >NAME: LED3  [CHIPLED_0603]  (hidden comment: LED-RED/D/0603)
LED4  >NAME: LED4  [CHIPLED_0603]  (hidden comment: LED-GREEN/D/0603)
LED5  >NAME: LED5  [CHIPLED_0603]  (hidden comment: LED-YELLOW/D/0603)
LED7  >NAME: LED7  [CHIPLED_0603]  (hidden comment: LED-GREEN/D/0603)
LED8  >NAME: LED8  [CHIPLED_0603]  (hidden comment: LED-RED/D/0603)
Q2  >NAME: Q2  [32X25_4PAD]  (hidden comment: 12MHZ/S/3.2X2.5)
R1  10k  [R0603]
R20  >NAME: R20  [R0603]  (hidden comment: 680R)
R21  >NAME: R21  [R0603]  (hidden comment: 680R)
R22  >NAME: R22  [R0603]  (hidden comment: 680R)
R23  >NAME: R23  [R0603]  (hidden comment: 680R)
R25  510R  [R0402]
R201  >NAME: R201  [R0603]  (hidden comment: 680R)
R202  >NAME: R202  [R0603]  (hidden comment: 680R)
R204  22R  [R0402]
R205  510R  [R0603]
R206  22R  [R0402]
R207  >NAME: R207  [R0402]  (hidden comment: 4.7k)
R208  >NAME: R208  [R0402]  (hidden comment: 10k)
R211  >NAME: R211  [R0402]  (hidden comment: 10k)
SJ1  >NAME: SJ1  [SJ]  (hidden comment: SJ)
SW1  >NAME: SW1  [FSM2JSMA]  (hidden comment: TMPS2-SMD)
U$9  127MARKED  [PINHEAD_127]  (value not drawn)
U$11  SEGGER.L_100  [LOGO_100]  (value not drawn)
USB1  vertical  [USBVERTICAL]
V203  >NAME: V203  [SOD323-R]  (hidden comment: BAT60A)
XMC4200  >NAME: XMC4200  [QFN-48-7X7]  (hidden comment: XMC4200_QFN48)

### Ports
DBGPRES#

### Nets
GND: C20.2 C39.2 C40.2 C41.2 C42.2 C43.2 C204.2 C205.2 C206.2 C208.2 C209.2 C210.2 C211.2 C212.2 C213.2 CON2.3 CON2.5 D7.3 IC1.4(GND) IC2.4(GND) JP2.2 LED2.C LED3.C LED4.C LED5.C R208.1 SW1.S SW1.S1(S) U$9.P$5 USB1.1 XMC4200.11(P14.7) XMC4200.12(P14.6) XMC4200.13(P14.5) XMC4200.14(P14.4) XMC4200.17(VAGND) XMC4200.20(P14.8) XMC4200.27(VSS) XMC4200.EPAD
VDD3.3: C39.1 C42.1 C43.1 C204.1 C211.1 C212.1 C213.1 CON2.1 IC1.1(VCCA) IC1.5(DIR) IC2.1(VCCA) IC2.5(DIR) R1.2 R201.1 R202.1 R211.2 U$9.P$1 XMC4200.5(VDDP) XMC4200.10(VBAT) XMC4200.18(VAREF) XMC4200.28(VDDP1) XMC4200.41(VDDP2)
VDD5: C40.1 C41.1 IC1.8(VCCB) IC2.8(VCCB) V203.C
AUX_LED#: LED8.C XMC4200.1(P0.1)
CS: XMC4200.23(P2.3) XMC4200.40(P1.0)
DBGPRES#: CON2.9
DEBUG_LED#: LED7.C XMC4200.48(P0.2)
DEBUG_RX_XMC42/TX_XMC45: XMC4200.46(P0.4)
DEBUG_TX_XMC42/RX_XMC45: R25.2
P0.7: CON2.8
P0.9: R20.2
P1.0: IC1.2(A1)
P1.1: IC1.3(A2)
P1.2: IC2.2(A1)
P1.3: IC2.3(A2)
P3.0: R22.2
P3.1: R23.2
P3.2: R21.2
PWM_MC1: IC1.7(B1)
PWM_MC2: IC1.6(B2)
PWM_MC3: IC2.7(B1)
PWM_MC4: IC2.6(B2)
RESET#: C20.1 D5.2(A) R1.1 SW1.P SW1.P1(P)
SWV: CON2.6 SJ1.2
SWV_DBG: SJ1.1 XMC4200.2(P0.0) XMC4200.24(P2.2)
TCK: CON2.4 XMC4200.22(P2.4) XMC4200.39(P1.1)
TMS: CON2.2 XMC4200.35(P1.5) XMC4200.36(P1.4)
USBVCC: L6.1 USB1.5
WTCK: U$9.P$2 XMC4200.34(TCK)
WTMS: U$9.P$3 XMC4200.33(TMS)
WUSB_DM: R204.1 XMC4200.3(USB_D-)
WUSB_DP: R206.1 XMC4200.4(USB_D+)
WVDDC: C208.1 C209.1 C210.1 XMC4200.6(VDDC) XMC4200.31(VDDC1)
NetC205_1: C205.1 Q2.1 R205.2
NetC206_1: C206.1 Q2.3 XMC4200.29(XTAL1)
NetCON2_10: CON2.10 D5.1(C)
NetD7_1: D7.1 R204.2 USB1.4
NetD7_2: D7.2 R206.2 USB1.3+(3)
NetJP2_1: JP2.1 R211.1 U$9.P$4 XMC4200.32(PORST#) ; port DBGPRES#
NetL6_2: L6.2 R207.2 V203.A
NetLED2_A: LED2.A R20.1
NetLED3_A: LED3.A R21.1
NetLED4_A: LED4.A R22.1
NetLED5_A: LED5.A R23.1
NetLED7_A: LED7.A R201.2
NetLED8_A: LED8.A R202.2
NetR25_1: R25.1 XMC4200.45(P0.5)
NetR205_1: R205.1 XMC4200.30(XTAL2)
NetR207_1: R207.1 R208.2 XMC4200.7(HIB_IO_0)

Not connected (* = marked no-connect by the designer): CON2 7; USB1 2 P$1(PGH1) P$2(PGH2) P$3(PGH3) P$4(PGH4); XMC4200 8(RTC_XTAL_1) 9(RTC_XTAL_2) 15(P14.3) 16(P14.0) 19(P14.9) 21(P2.5) 25(P2.1) 26(P2.0) 37(P1.3) 38(P1.2) 42(P0.8) 43(P0.7) 44(P0.6) 47(P0.3)

### Notes on the sheet
- Level Shifter for PWM-Output 5V
- On Board Debugger (OBD) XMC4200
- unidirectional output from A to B
- Reset
- DEBUG USB
  (vertical)
- State LEDs
- JP2 (OBD disable) sets debugger in reset-mode
  (less power consumption)
- Cortex Debug
  Pinpitch:1.27mm
- (near D5) D5
- 1
- 2
- 3
- 4
- 5
- 6
- 7
- 8
- A
- B
- C
- D
- E

### Library data of the parts
C20 C40-C43 = C-EUC0603: <B>CAPACITOR</B>, European symbol
C39 C210 = C-EUC0805K: <B>CAPACITOR</B>, European symbol
C204-C206 C208 C209 C211-C213 = C-EUC0402
  C204: >VALUE: 100n
JP2 = PINHD-1X2: <b>PIN HEADER</b>
L6 = L_EU_L0603
LED2-LED5 LED7 LED8 = LEDCHIPLED_0603: as LED1 on sheet LARIX_V5_1
  LED2 LED4 LED7: >VALUE: LED-GREEN/D/0603
  LED3 LED8: >VALUE: LED-RED/D/0603
  LED5: >VALUE: LED-YELLOW/D/0603
Q2 = NX3225_2: >VALUE: 12MHZ/S/3.2X2.5; 1: 1; 2: 2
R1 = R-EU_R0603: <B>RESISTOR</B>, European symbol
R20-R23 R201 R202 R205 = R-EU_R0603
  R20-R23 R201 R202: >VALUE: 680R
R25 R204 R206-R208 R211 = R-EU_R0402
  R207: >VALUE: 4.7k
  R208 R211: >VALUE: 10k
SJ1 = SJ: SMD solder <b>JUMPER</b>; >VALUE: SJ
SW1 = FSM2JSMA: >VALUE: TMPS2-SMD
USB1 = MICRO_USB_VERTICAL
V203 = BAT60: >VALUE: BAT60A
IC1 IC2 = SN74LVC2T45DCT: >VALUE: SN74LVC2T45DCT
XMC4200 = XMC4200_QFN48: >VALUE: XMC4200_QFN48; USB: USB; Supply: Supply; Analog: Analog; Digital: Digital; Hibernate/RTC: Hibernate/RTC

## Nets that join several sheets
GND: LARIX_V5_0 (32 pins), LARIX_V5_1 (64 pins), LARIX_V5_2 (38 pins)
VDD3.3: LARIX_V5_0 (25 pins), LARIX_V5_1 (27 pins), LARIX_V5_2 (22 pins)
VDD5: LARIX_V5_0 (D2.C), LARIX_V5_1 (7 pins), LARIX_V5_2 (5 pins)